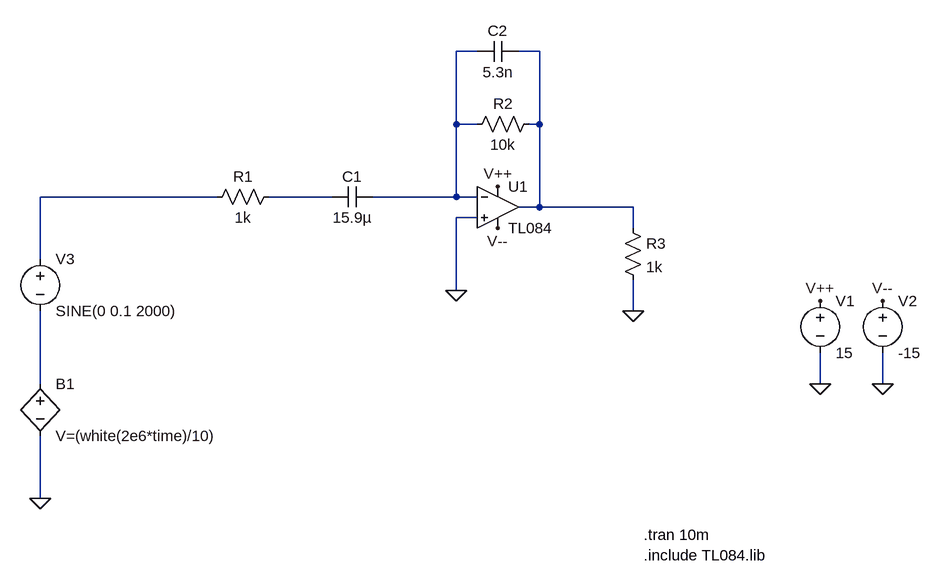
[diagram p0: schematic filtre_passe_bande.asc]
filtre_passe_bande.asc, the LTspice schematic file:
Version 4
SHEET 1 1456 760
WIRE 160 -32 128 -32
WIRE 256 -32 224 -32
WIRE 128 80 128 -32
WIRE 160 80 128 80
WIRE 256 80 256 -32
WIRE 256 80 240 80
WIRE -240 192 -512 192
WIRE -64 192 -160 192
WIRE 128 192 128 80
WIRE 128 192 0 192
WIRE 160 192 128 192
WIRE 256 208 256 80
WIRE 256 208 224 208
WIRE 400 208 256 208
WIRE 160 224 128 224
WIRE 400 240 400 208
WIRE -512 288 -512 192
WIRE 128 336 128 224
WIRE 400 368 400 320
WIRE -512 480 -512 368
WIRE 688 480 688 432
WIRE 784 480 784 432
WIRE -512 656 -512 560
FLAG 688 480 0
FLAG 784 480 0
FLAG -512 656 0
FLAG 128 336 0
FLAG 688 352 V++
FLAG 784 352 V--
FLAG 192 240 V--
FLAG 192 176 V++
FLAG 400 368 0
SYMBOL res 256 64 R90
WINDOW 0 0 56 VBottom 2
WINDOW 3 32 56 VTop 2
SYMATTR InstName R2
SYMATTR Value 10k
SYMBOL cap 224 -48 R90
WINDOW 0 0 32 VBottom 2
WINDOW 3 32 32 VTop 2
SYMATTR InstName C2
SYMATTR Value 5.3n
SYMBOL cap 0 176 R90
WINDOW 0 0 32 VBottom 2
WINDOW 3 32 32 VTop 2
SYMATTR InstName C1
SYMATTR Value 15.9µ
SYMBOL res -144 176 R90
WINDOW 0 0 56 VBottom 2
WINDOW 3 32 56 VTop 2
SYMATTR InstName R1
SYMATTR Value 1k
SYMBOL Opamps\\opamp2 192 144 R0
SYMATTR InstName U1
SYMATTR Value TL084
SYMBOL voltage 688 336 R0
SYMATTR InstName V1
SYMATTR Value 15
SYMBOL voltage 784 336 R0
SYMATTR InstName V2
SYMATTR Value -15
SYMBOL voltage -512 272 R0
WINDOW 123 0 0 Left 0
WINDOW 39 0 0 Left 0
SYMATTR InstName V3
SYMATTR Value SINE(0 0.1 2000)
SYMBOL res 384 224 R0
SYMATTR InstName R3
SYMATTR Value 1k
SYMBOL bv -512 464 R0
SYMATTR InstName B1
SYMATTR Value V=(white(2e6*time)/10)
TEXT 416 744 Left 2 !.include TL084.lib
TEXT 416 712 Left 2 !.tran 10m

The netlist it stands for:
* filtre_passe_bande.asc
R2 N002 N001 10k
C2 N002 N001 5.3n
C1 N001 N004 15.9µ
R1 N004 N003 1k
XU1 0 N001 V++ V-- N002 TL084  ; pins In+ In- V+ V- OUT
V1 V++ 0 15
V2 V-- 0 -15
V3 N003 N005 SINE(0 0.1 2000)
R3 N002 0 1k
B1 N005 0 V=(white(2e6*time)/10)
.include TL084.lib
.tran 10m
.backanno
.end